# EAGLE schematic 8x8_328 (EAGLE 6.6.0)
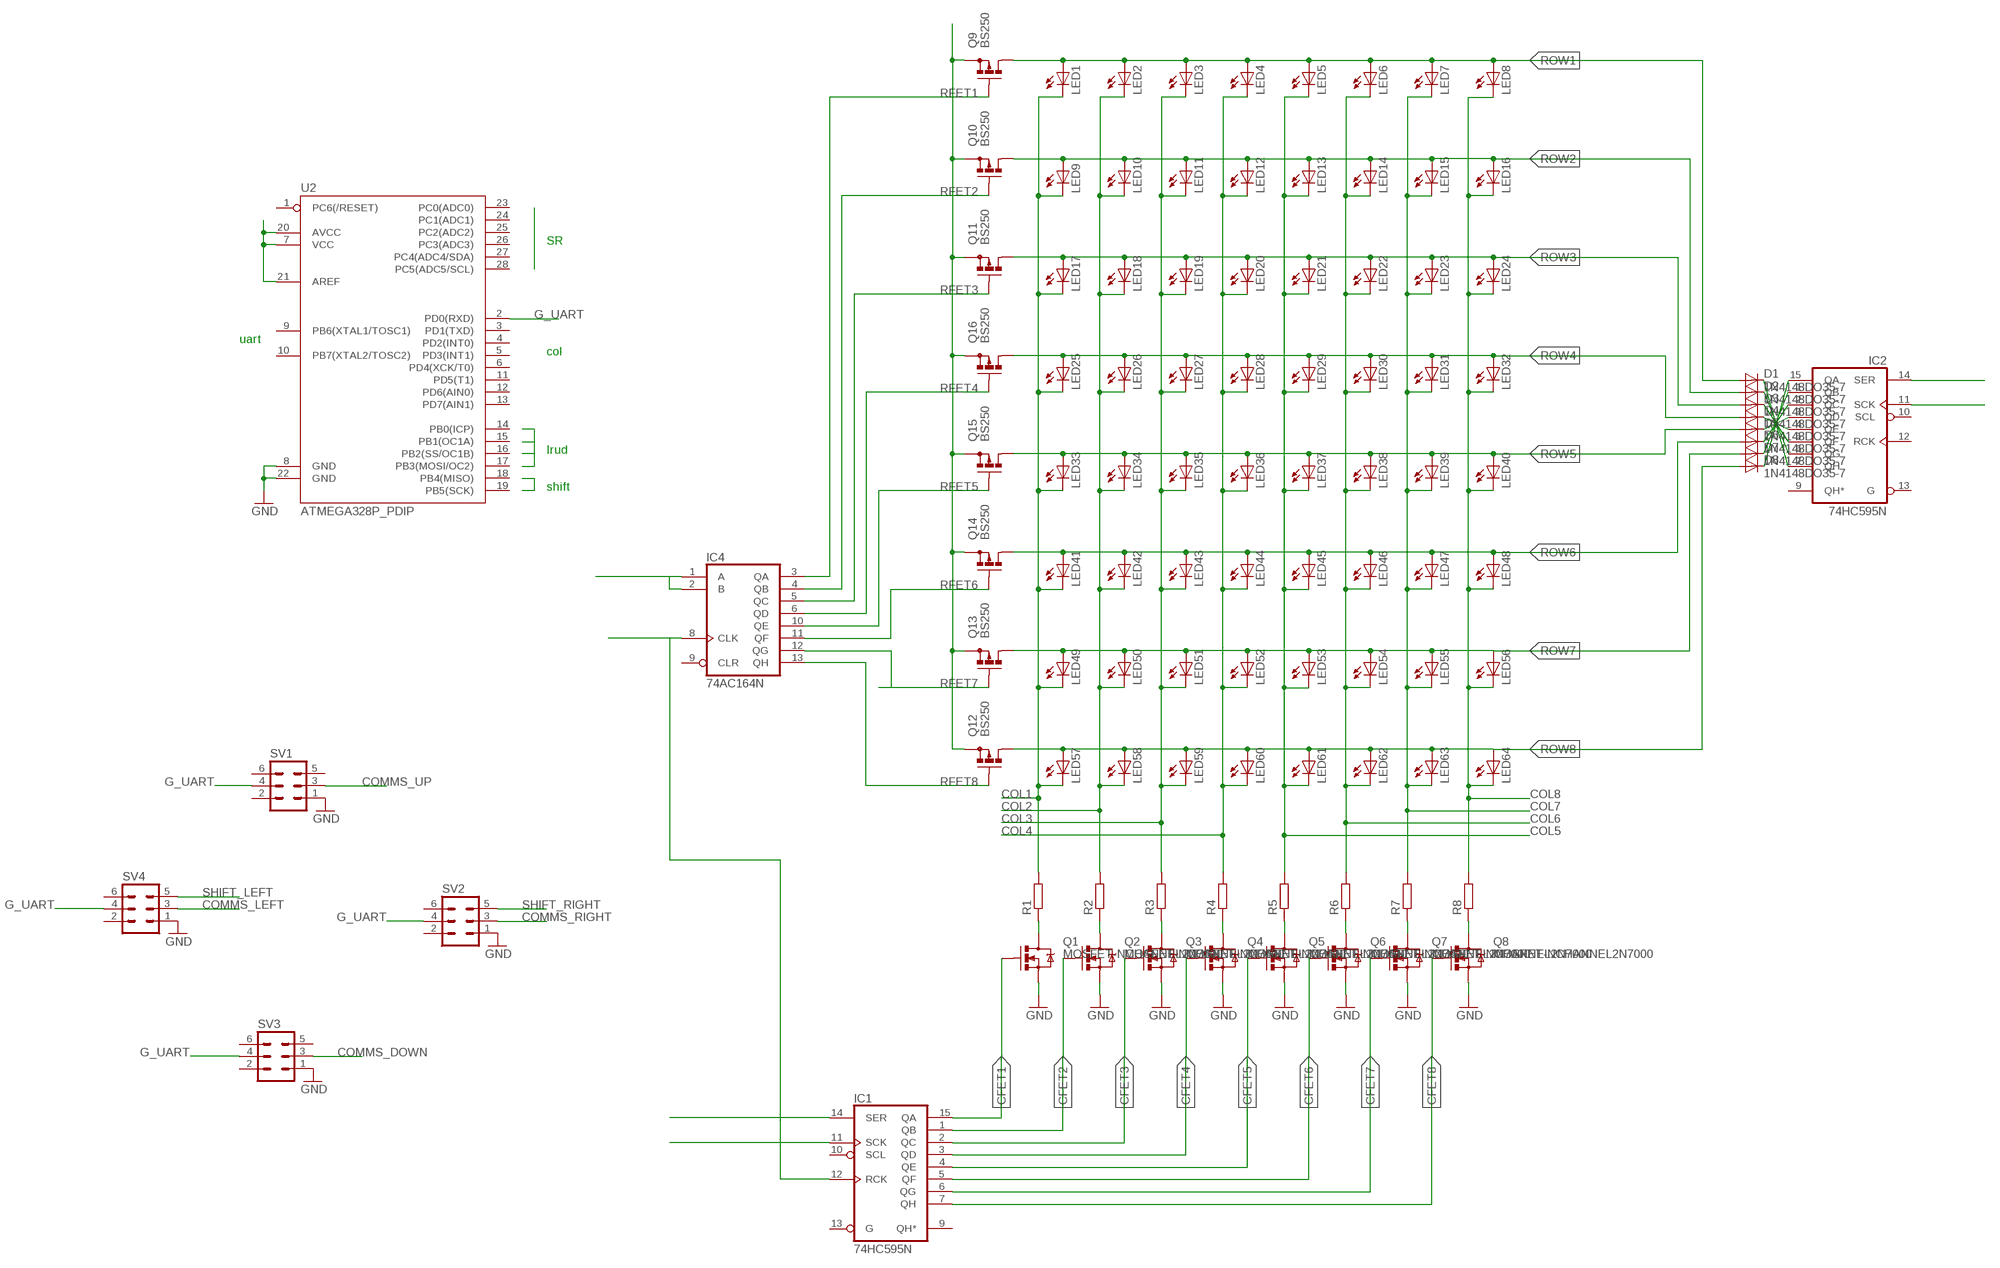
[diagram p0: schematic, sheet 1]

## Parts
D1  1N4148DO35-7  [DO35-7]
D2  1N4148DO35-7  [DO35-7]
D3  1N4148DO35-7  [DO35-7]
D4  1N4148DO35-7  [DO35-7]
D5  1N4148DO35-7  [DO35-7]
D6  1N4148DO35-7  [DO35-7]
D7  1N4148DO35-7  [DO35-7]
D8  1N4148DO35-7  [DO35-7]
IC1  74HC595N  [DIL16]
IC2  74HC595N  [DIL16]
IC4  74AC164N  [DIL14]
LED1  LED5MM  [LED5MM]
LED2  LED5MM  [LED5MM]
LED3  LED5MM  [LED5MM]
LED4  LED5MM  [LED5MM]
LED5  LED5MM  [LED5MM]
LED6  LED5MM  [LED5MM]
LED7  LED5MM  [LED5MM]
LED8  LED5MM  [LED5MM]
LED9  LED5MM  [LED5MM]
LED10  LED5MM  [LED5MM]
LED11  LED5MM  [LED5MM]
LED12  LED5MM  [LED5MM]
LED13  LED5MM  [LED5MM]
LED14  LED5MM  [LED5MM]
LED15  LED5MM  [LED5MM]
LED16  LED5MM  [LED5MM]
LED17  LED5MM  [LED5MM]
LED18  LED5MM  [LED5MM]
LED19  LED5MM  [LED5MM]
LED20  LED5MM  [LED5MM]
LED21  LED5MM  [LED5MM]
LED22  LED5MM  [LED5MM]
LED23  LED5MM  [LED5MM]
LED24  LED5MM  [LED5MM]
LED25  LED5MM  [LED5MM]
LED26  LED5MM  [LED5MM]
LED27  LED5MM  [LED5MM]
LED28  LED5MM  [LED5MM]
LED29  LED5MM  [LED5MM]
LED30  LED5MM  [LED5MM]
LED31  LED5MM  [LED5MM]
LED32  LED5MM  [LED5MM]
LED33  LED5MM  [LED5MM]
LED34  LED5MM  [LED5MM]
LED35  LED5MM  [LED5MM]
LED36  LED5MM  [LED5MM]
LED37  LED5MM  [LED5MM]
LED38  LED5MM  [LED5MM]
LED39  LED5MM  [LED5MM]
LED40  LED5MM  [LED5MM]
LED41  LED5MM  [LED5MM]
LED42  LED5MM  [LED5MM]
LED43  LED5MM  [LED5MM]
LED44  LED5MM  [LED5MM]
LED45  LED5MM  [LED5MM]
LED46  LED5MM  [LED5MM]
LED47  LED5MM  [LED5MM]
LED48  LED5MM  [LED5MM]
LED49  LED5MM  [LED5MM]
LED50  LED5MM  [LED5MM]
LED51  LED5MM  [LED5MM]
LED52  LED5MM  [LED5MM]
LED53  LED5MM  [LED5MM]
LED54  LED5MM  [LED5MM]
LED55  LED5MM  [LED5MM]
LED56  LED5MM  [LED5MM]
LED57  LED5MM  [LED5MM]
LED58  LED5MM  [LED5MM]
LED59  LED5MM  [LED5MM]
LED60  LED5MM  [LED5MM]
LED61  LED5MM  [LED5MM]
LED62  LED5MM  [LED5MM]
LED63  LED5MM  [LED5MM]
LED64  LED5MM  [LED5MM]
Q1  MOSFET-NCHANNEL2N7000  [TO-92]
Q2  MOSFET-NCHANNEL2N7000  [TO-92]
Q3  MOSFET-NCHANNEL2N7000  [TO-92]
Q4  MOSFET-NCHANNEL2N7000  [TO-92]
Q5  MOSFET-NCHANNEL2N7000  [TO-92]
Q6  MOSFET-NCHANNEL2N7000  [TO-92]
Q7  MOSFET-NCHANNEL2N7000  [TO-92]
Q8  MOSFET-NCHANNEL2N7000  [TO-92]
Q9  BS250  [SOT54E]
Q10  BS250  [SOT54E]
Q11  BS250  [SOT54E]
Q12  BS250  [SOT54E]
Q13  BS250  [SOT54E]
Q14  BS250  [SOT54E]
Q15  BS250  [SOT54E]
Q16  BS250  [SOT54E]
R1  R-EU_0207/10  [0207/10]
R2  R-EU_0207/10  [0207/10]
R3  R-EU_0207/10  [0207/10]
R4  R-EU_0207/10  [0207/10]
R5  R-EU_0207/10  [0207/10]
R6  R-EU_0207/10  [0207/10]
R7  R-EU_0207/10  [0207/10]
R8  R-EU_0207/10  [0207/10]
SV1  MA03-2  [MA03-2]
SV2  MA03-2  [MA03-2]
SV3  MA03-2  [MA03-2]
SV4  MA03-2  [MA03-2]
U2  ATMEGA328P_PDIP  [DIL28-3]

## Nets
CFET1: IC1.15(QA) Q1.2(G)
CFET2: IC1.1(QB) Q2.2(G)
CFET3: IC1.2(QC) Q3.2(G)
CFET4: IC1.3(QD) Q4.2(G)
CFET5: IC1.4(QE) Q5.2(G)
CFET6: IC1.5(QF) Q6.2(G)
CFET7: IC1.6(QG) Q7.2(G)
CFET8: IC1.7(QH) Q8.2(G)
COL1: LED1.K(C) LED9.K(C) LED17.K(C) LED25.K(C) LED33.K(C) LED41.K(C) LED49.K(C) LED57.K(C) R1.2
COL2: LED2.K(C) LED10.K(C) LED18.K(C) LED26.K(C) LED34.K(C) LED42.K(C) LED50.K(C) LED58.K(C) R2.2
COL3: LED3.K(C) LED11.K(C) LED19.K(C) LED27.K(C) LED35.K(C) LED43.K(C) LED51.K(C) LED59.K(C) R3.2
COL4: LED4.K(C) LED12.K(C) LED20.K(C) LED28.K(C) LED36.K(C) LED44.K(C) LED52.K(C) LED60.K(C) R4.2
COL5: LED5.K(C) LED13.K(C) LED21.K(C) LED29.K(C) LED37.K(C) LED45.K(C) LED53.K(C) LED61.K(C) R5.2
COL6: LED6.K(C) LED14.K(C) LED22.K(C) LED30.K(C) LED38.K(C) LED46.K(C) LED54.K(C) LED62.K(C) R6.2
COL7: LED7.K(C) LED15.K(C) LED23.K(C) LED31.K(C) LED39.K(C) LED47.K(C) LED55.K(C) LED63.K(C) R7.2
COL8: LED8.K(C) LED16.K(C) LED24.K(C) LED32.K(C) LED40.K(C) LED48.K(C) LED56.K(C) LED64.K(C) R8.2
COMMS_DOWN: SV3.3
COMMS_LEFT: SV4.3
COMMS_RIGHT: SV2.3
COMMS_UP: SV1.3
G_UART: SV1.4 SV2.4 SV3.4 SV4.4 U2.2(PD0(RXD))
GND: Q1.1(S) Q2.1(S) Q3.1(S) Q4.1(S) Q5.1(S) Q6.1(S) Q7.1(S) Q8.1(S) SV1.1 SV2.1 SV3.1 SV4.1 U2.8(GND) U2.22(GND)
N$1: Q8.3(D) R8.1
N$2: Q7.3(D) R7.1
N$3: Q6.3(D) R6.1
N$4: Q5.3(D) R5.1
N$5: Q4.3(D) R4.1
N$6: Q3.3(D) R3.1
N$7: Q2.3(D) R2.1
N$8: Q1.3(D) R1.1
N$9: IC1.12(RCK) IC4.8(CLK)
N$10: IC4.1(A) IC4.2(B)
N$11: IC2.14(SER)
N$12: IC2.11(SCK)
N$13: IC1.14(SER)
N$14: D1.C IC2.7(QH)
N$15: IC1.11(SCK)
N$16: U2.7(VCC) U2.20(AVCC) U2.21(AREF)
N$20: D8.C IC2.15(QA)
N$21: D7.C IC2.1(QB)
N$22: D6.C IC2.2(QC)
N$23: D5.C IC2.3(QD)
N$24: D4.C IC2.4(QE)
N$25: D3.C IC2.5(QF)
N$26: D2.C IC2.6(QG)
N$29: Q9.S Q10.S Q11.S Q12.S Q13.S Q14.S Q15.S Q16.S
RFET1: IC4.3(QA) Q9.G
RFET2: IC4.4(QB) Q10.G
RFET3: IC4.5(QC) Q11.G
RFET4: IC4.6(QD) Q16.G
RFET5: IC4.10(QE) Q15.G
RFET6: IC4.11(QF) Q14.G
RFET7: IC4.12(QG) Q13.G
RFET8: IC4.13(QH) Q12.G
ROW1: D1.A LED1.A LED2.A LED3.A LED4.A LED5.A LED6.A LED7.A LED8.A Q9.D
ROW2: D2.A LED9.A LED10.A LED11.A LED12.A LED13.A LED14.A LED15.A LED16.A Q10.D
ROW3: D3.A LED17.A LED18.A LED19.A LED20.A LED21.A LED22.A LED23.A LED24.A Q11.D
ROW4: D4.A LED25.A LED26.A LED27.A LED28.A LED29.A LED30.A LED31.A LED32.A Q16.D
ROW5: D5.A LED33.A LED34.A LED35.A LED36.A LED37.A LED38.A LED39.A LED40.A Q15.D
ROW6: D6.A LED41.A LED42.A LED43.A LED44.A LED45.A LED46.A LED47.A LED48.A Q14.D
ROW7: D7.A LED49.A LED50.A LED51.A LED52.A LED53.A LED54.A LED55.A LED56.A Q13.D
ROW8: D8.A LED57.A LED58.A LED59.A LED60.A LED61.A LED62.A LED63.A LED64.A Q12.D
SHIFT_LEFT: SV4.5
SHIFT_RIGHT: SV2.5
Unconnected: IC1.9(QH*) IC1.10(SCL) IC1.13(G) IC2.9(QH*) IC2.10(SCL) IC2.12(RCK) IC2.13(G) IC4.9(CLR) SV1.2 SV1.5 SV1.6 SV2.2 SV2.6 SV3.2 SV3.5 SV3.6 SV4.2 SV4.6 U2.1(PC6(/RESET)) U2.3(PD1(TXD)) U2.4(PD2(INT0)) U2.5(PD3(INT1)) U2.6(PD4(XCK/T0)) U2.9(PB6(XTAL1/TOSC1)) U2.10(PB7(XTAL2/TOSC2)) U2.11(PD5(T1)) U2.12(PD6(AIN0)) U2.13(PD7(AIN1)) U2.14(PB0(ICP)) U2.15(PB1(OC1A)) U2.16(PB2(SS/OC1B)) U2.17(PB3(MOSI/OC2)) U2.18(PB4(MISO)) U2.19(PB5(SCK)) U2.23(PC0(ADC0)) U2.24(PC1(ADC1)) U2.25(PC2(ADC2)) U2.26(PC3(ADC3)) U2.27(PC4(ADC4/SDA)) U2.28(PC5(ADC5/SCL))

## Notes on the sheet
- SR
- uart
- col
- lrud
- shift

## Power pins joined to a net without a drawn wire
GND: IC1.8(GND) IC2.8(GND) IC4.7(GND)
VCC: IC1.16(VCC) IC2.16(VCC) IC4.14(VCC)

## Library data of the parts
D1-D8 = diode:1N4148: DIODE high speed (Philips)
IC1 IC2 = 74xx-eu:74*595: 8-bit SHIFT REGISTER, output latch
IC4 = 74xx-eu:74*164: 8-bit parallel out SHIFT REGISTER
LED1-LED64 = dtb:LED: LED OSRAM: - CHIPLED LG R971, LG N971, LY N971, LG Q971, LY Q971, LO R971, LY R971 LH N974, LH R974 LS Q976, LO Q976, LY Q976 LO Q996 - Hyper CHIPLED LW Q18S LB Q993, LB Q99A, LB R99A - SideLED LS A670, LO A670, LY A670, LG A670, LP A670 LB A673, LV A673, LT A673, LW A673 LH A674 LY A675 LS A676, LA A676, LO A676, LY A676, LW A676 LS A679, LY A679, LG A679 - Hyper Micro SIDELED® LS Y876, LA Y876, LO Y876, LY Y876 LT Y87S - SmartLED LW L88C, LW L88S LB L89C, LB L89S, LG L890 LS L89K, LO L89K, LY L89K LS L896, LA L896, LO L896, LY L896 - TOPLED LS T670, LO T670, LY T670, LG T670, LP T670 LSG T670, LSP T670, LSY T670, LOP T670, LYG T670 LG T671, LOG T671, LSG T671 LB T673, LV T673, LT T673, LW T673 LH T674 LS T676, LA T676, LO T676, LY T676, LB T676, LH T676, LSB T676, LW T676 LB T67C, LV T67C, LT T67C, LS T67K, LO T67K, LY T67K, LW E67C LS E67B, LA E67B, LO E67B, LY E67B, LB E67C, LV E67C, LT E67C LW T67C LS T679, LY T679, LG T679 LS T770, LO T770, LY T770, LG T770, LP T770 LB T773, LV T773, LT T773, LW T773 LH T774 LS E675, LA E675, LY E675, LS T675 LS T776, LA T776, LO T776, LY T776, LB T776 LHGB T686 LT T68C, LB T68C - Hyper Mini TOPLED® LB M676 - Mini TOPLED Santana® LG M470 LS M47K, LO M47K, LY M47K Source: http://www.osram.convergy.de LUXEON: - LUMILED® LXK2-PW12-R00, LXK2-PW12-S00, LXK2-PW14-U00, LXK2-PW14-V00 LXK2-PM12-R00, LXK2-PM12-S00, LXK2-PM14-U00 LXK2-PE12-Q00, LXK2-PE12-R00, LXK2-PE12-S00, LXK2-PE14-T00, LXK2-PE14-U00 LXK2-PB12-K00, LXK2-PB12-L00, LXK2-PB12-M00, LXK2-PB14-N00, LXK2-PB14-P00, LXK2-PB14-Q00 LXK2-PR12-L00, LXK2-PR12-M00, LXK2-PR14-Q00, LXK2-PR14-R00 LXK2-PD12-Q00, LXK2-PD12-R00, LXK2-PD12-S00 LXK2-PH12-R00, LXK2-PH12-S00 LXK2-PL12-P00, LXK2-PL12-Q00, LXK2-PL12-R00 Source: www.luxeon.com KINGBRIGHT: KA-3528ASYC Source: www.kingbright.com
Q1-Q8 = SparkFun-DiscreteSemi:MOSFET-NCHANNEL: Common NMOSFET Parts MFG P/N Store ID Prod ID FDD8780 TRANS-09984 SI7820DN TRANS-11055 FDS6630A IC-08089 2N7002PW TRANS-11151 FQP30N06L COM-10213 TRANS-10060 BSS123LT1G TRANS-08345 BSS138 TRANS-00830 BS170 2N7000
Q9-Q16 = transistor-small-signal:BS250: P-CHANNEL MOS FET
R1-R8 = resistor:R-EU_: RESISTOR, European symbol
SV1-SV4 = con-lstb:MA03-2: PIN HEADER; OC_FARNELL: unknown; OC_NEWARK: unknown
U2 = SparkFun-DigitalIC:ATMEGA328P_PDIP: uC used in the Arduino 32kb flash, 1k EEPROM, 2k SRAM This is the through-hole version of this chip.